# EAGLE design EddieBoardA_v2 (EAGLE 7.0.0)
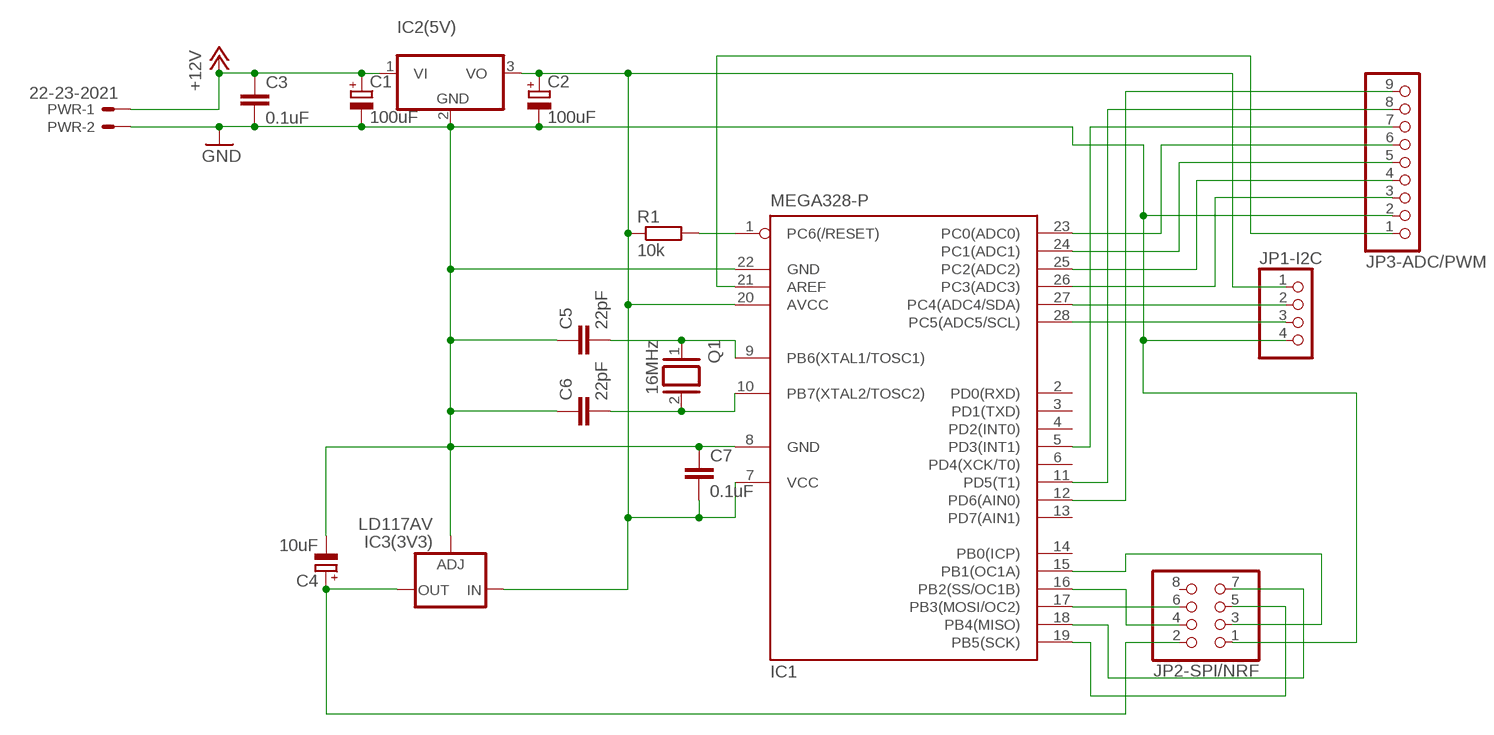
[diagram p0: schematic, sheet 1]

## Parts
C1  100uF  CPOL-EUE2.5-6  [E2,5-6]
C2  100uF  CPOL-EUE2.5-6  [E2,5-6]
C3  0.1uF  C-EU025-025X050  [C025-025X050]
C4  10uF  CPOL-EUE2.5-6  [E2,5-6]
C5  22pF  C-EU025-025X050  [C025-025X050]
C6  22pF  C-EU025-025X050  [C025-025X050]
C7  0.1uF  C-EU025-025X050  [C025-025X050]
IC1  MEGA328-P  MEGA8-P  [DIL28-3]
IC2(5V)  7805TV  [TO220V]
IC3(3V3)  LD117AV  [TO220L1]
JP1-I2C  PINHD-1X4  [1X04]
JP2-SPI/NRF  PINHD-2X4  [2X04]
JP3-ADC/PWM  PINHD-1X9  [1X09]
PWR  22-23-2021  [22-23-2021]
Q1  16MHz  XTAL/S  [QS]
R1  10k  R-EU_0207/12  [0207/12]

## Nets
3V3: C4.+ IC3(3V3).2(OUT) JP2-SPI/NRF.2
+12V: C1.+ C3.1 IC2(5V).1(VI) PWR.1
GND: C1.- C2.- C3.2 C4.- C5.1 C6.1 C7.1 IC1.8(GND) IC1.22(GND) IC2(5V).2(GND) IC3(3V3).1(ADJ) JP1-I2C.4 JP2-SPI/NRF.1 JP3-ADC/PWM.2 PWR.2
MISO: IC1.18(PB4(MISO)) JP2-SPI/NRF.7
MOSI: IC1.17(PB3(MOSI/OC2)) JP2-SPI/NRF.6
N$1: IC1.1(PC6(/RESET)) R1.2
N$4: C5.2 IC1.9(PB6(XTAL1/TOSC1)) Q1.1
N$5: C6.2 IC1.10(PB7(XTAL2/TOSC2)) Q1.2
N$8: IC1.15(PB1(OC1A)) JP2-SPI/NRF.3
N$12: IC1.21(AREF) JP3-ADC/PWM.1
N$13: IC1.26(PC3(ADC3)) JP3-ADC/PWM.3
N$14: IC1.25(PC2(ADC2)) JP3-ADC/PWM.4
N$15: IC1.24(PC1(ADC1)) JP3-ADC/PWM.5
N$16: IC1.23(PC0(ADC0)) JP3-ADC/PWM.6
N$19: IC1.5(PD3(INT1)) JP3-ADC/PWM.7
N$20: IC1.11(PD5(T1)) JP3-ADC/PWM.8
N$21: IC1.12(PD6(AIN0)) JP3-ADC/PWM.9
SCK: IC1.19(PB5(SCK)) JP2-SPI/NRF.5
SCL: IC1.28(PC5(ADC5/SCL)) JP1-I2C.3
SDA: IC1.27(PC4(ADC4/SDA)) JP1-I2C.2
SS: IC1.16(PB2(SS/OC1B)) JP2-SPI/NRF.4
VCC: C2.+ C7.2 IC1.7(VCC) IC1.20(AVCC) IC2(5V).3(VO) IC3(3V3).3(IN) JP1-I2C.1 R1.1
Unconnected: IC1.2(PD0(RXD)) IC1.3(PD1(TXD)) IC1.4(PD2(INT0)) IC1.6(PD4(XCK/T0)) IC1.13(PD7(AIN1)) IC1.14(PB0(ICP)) JP2-SPI/NRF.8

## Library data of the parts
C1 C2 C4 = rcl:CPOL-EU: POLARIZED CAPACITOR, European symbol
C3 C5-C7 = rcl:C-EU: CAPACITOR, European symbol
IC1 = atmel:MEGA8-P: MICROCONTROLLER 8 Kbytes FLASH, 1 kbytes SRAM, 512 bytes EEPROM, USART, 4-channel 10 bit ADC, 2-channel 8 bit ADC Pin compatible with Atmega48, ATMega88, ATMega168 Source: avr.lbr; OC_FARNELL: unknown; OC_NEWARK: unknown
IC2(5V) = linear:78*: Positive VOLTAGE REGULATOR Source: http://cache.national.com/ds/LM/LM78L05.pdf http://www.fairchildsemi.com/ds/LM/LM7805.pdf
IC3(3V3) = v-reg_2:LD117A?*: Low drop fixed and adjustable positive voltage regulators 1 A Source: http://www.st.com/stonline/products/literature/ds/7194/ld1117axx.pdf
JP1-I2C = pinhead:PINHD-1X4: PIN HEADER
JP2-SPI/NRF = pinhead:PINHD-2X4: PIN HEADER
JP3-ADC/PWM = pinhead:PINHD-1X9: PIN HEADER
PWR = con-molex:22-23-2021: .100" (2.54mm) Center Header - 2 Pin; MF: MOLEX; MPN: PWR; OC_FARNELL: 1462926; OC_NEWARK: 25C3832
Q1 = special:XTAL/S: CRYSTAL
R1 = resistor:R-EU_: RESISTOR, European symbol

## Board
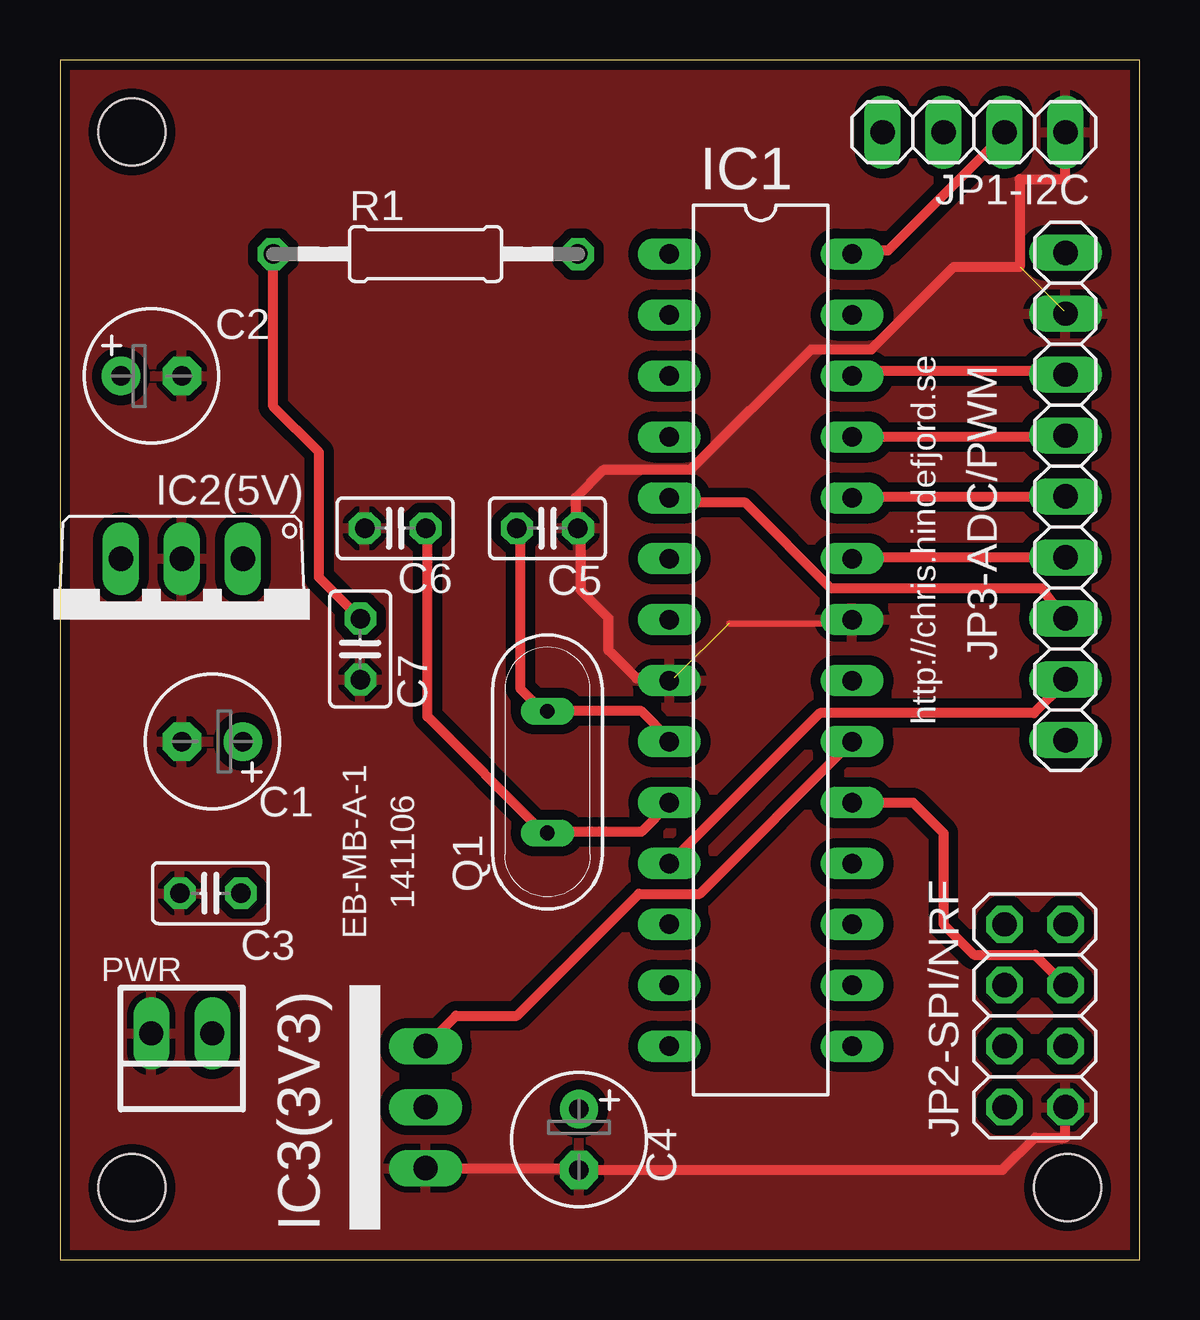
[diagram p1: board, top side]
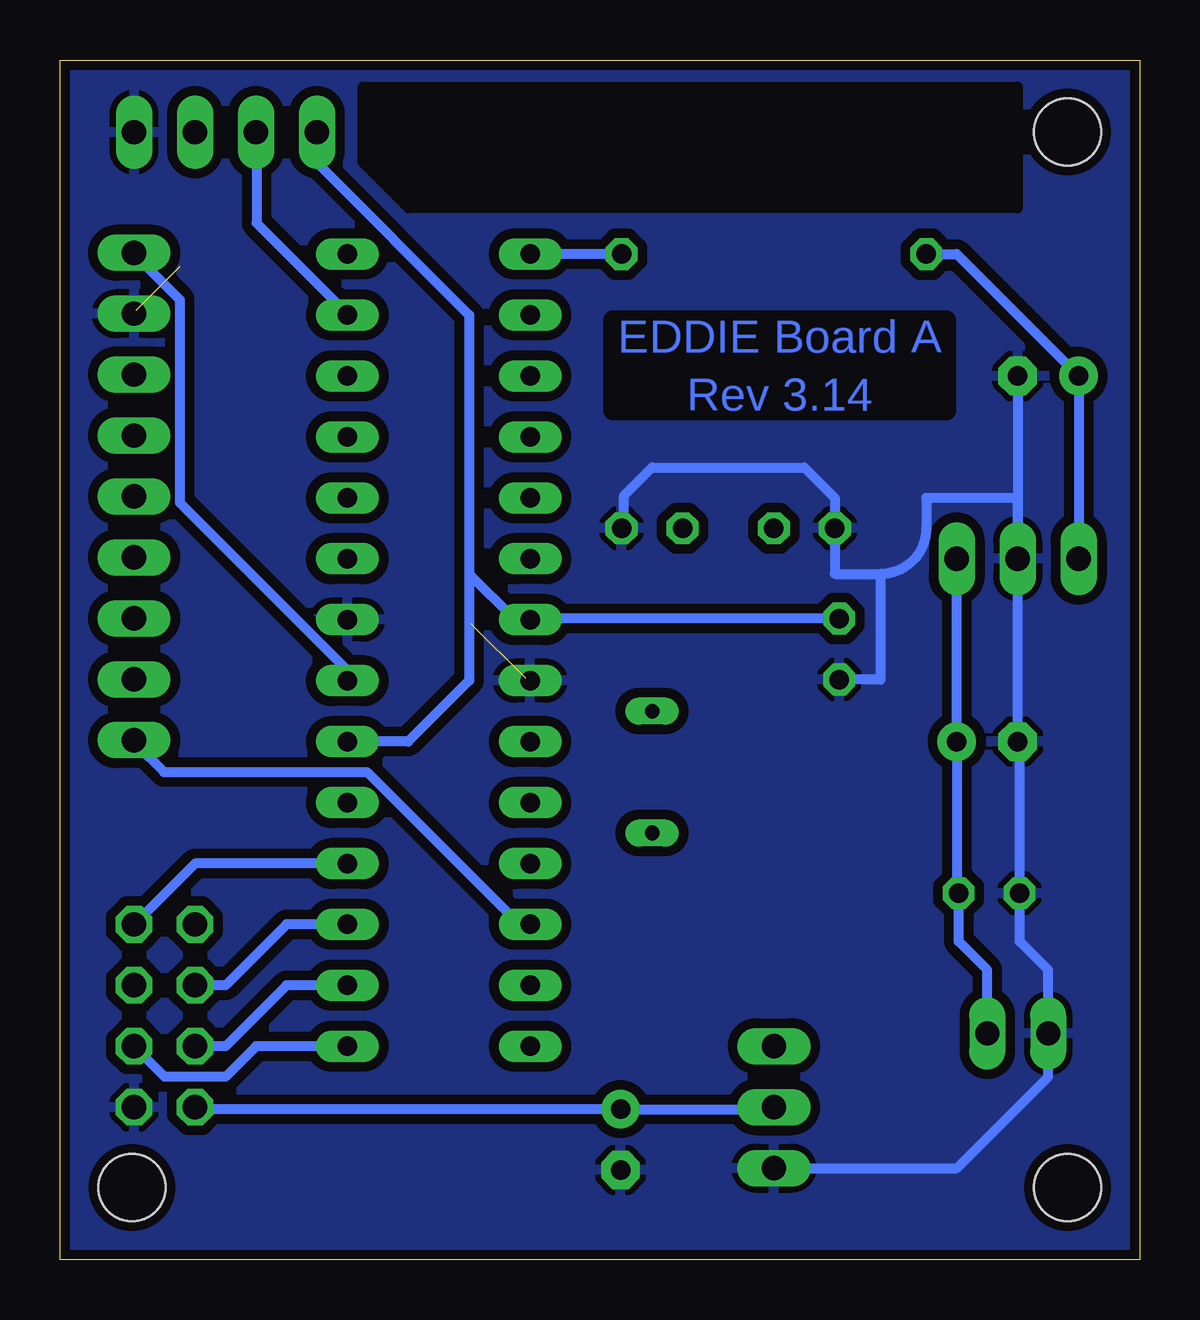
[diagram p2: board, bottom side, seen from below]

Size 45 x 50 mm. Coordinates in mm from the lower left corner, seen from the top.
Outline: 0,0 45,0 45,50 0,50 0,0
Copper layers (1*16): Top 0.035mm / dielectric 1.5mm / Bottom 0.035mm
Design rules "dirt_cheap_dirty_boards.v1": minimum track width 5mil, minimum drill 12mil, track to track 5mil, track to pad 5mil, pad to pad 5mil, via to via 5mil, smd to smd 0mil, copper to edge 10mil, drill to drill 10mil, minimum pad ring 10mil, minimum via ring 6mil, stop-mask expansion 2mil, vias tented up to drill 25mil, thermal gap 10mil
Holes 2.8 mm at 3,47 42,3 3,3

### Footprints (pad centres in the part's own frame; a part is rotated, then mirrored left to right if it is on the bottom)
E2,5-6 = drill 0.813 pad 1.6: + -1.27,0 | drill 0.813 pad 1.6 octagon: - 1.27,0
C025-025X050 = drill 0.813 octagon: 1 -1.27,0; 2 1.27,0
DIL28-3 = drill 0.813 long: 1 -16.51,-3.81; 2 -13.97,-3.81; 3 -11.43,-3.81; 4 -8.89,-3.81; 5 -6.35,-3.81; 6 -3.81,-3.81; 7 -1.27,-3.81; 8 1.27,-3.81; 9 3.81,-3.81; 10 6.35,-3.81; 11 8.89,-3.81; 12 11.43,-3.81; 13 13.97,-3.81; 14 16.51,-3.81; 15 16.51,3.81; 16 13.97,3.81; 17 11.43,3.81; 18 8.89,3.81; 19 6.35,3.81; 20 3.81,3.81; 21 1.27,3.81; 22 -1.27,3.81; 23 -3.81,3.81; 24 -6.35,3.81; 25 -8.89,3.81; 26 -11.43,3.81; 27 -13.97,3.81; 28 -16.51,3.81
TO220V = drill 1.016 long: 1 -2.54,-2.54; 2 0,-2.54; 3 2.54,-2.54
TO220L1 = drill 1.016 long: 1 -2.54,-3.81; 2 0,-3.81; 3 2.54,-3.81
1X04 = drill 1.016 long: 1 -3.81,0; 2 -1.27,0; 3 1.27,0; 4 3.81,0
2X04 = drill 1.016 octagon: 1 -3.81,-1.27; 2 -3.81,1.27; 3 -1.27,-1.27; 4 -1.27,1.27; 5 1.27,-1.27; 6 1.27,1.27; 7 3.81,-1.27; 8 3.81,1.27
1X09 = drill 1.016 long: 1 -10.16,0; 2 -7.62,0; 3 -5.08,0; 4 -2.54,0; 5 0,0; 6 2.54,0; 7 5.08,0; 8 7.62,0; 9 10.16,0
22-23-2021 = drill 1 long: 1 -1.27,0; 2 1.27,0
QS = drill 0.61 long: 1 -2.54,0; 2 2.54,0
0207/12 = drill 0.813 octagon: 1 -6.35,0; 2 6.35,0

### Placement (x,y rotation side)
C1  6.35,21.59 180 top
C2  3.81,36.83 0 top
C3  6.27,15.27 180 top
C4  21.64,5 270 top
C5  20.32,30.48 180 top
C6  13.97,30.48 0 top
C7  12.52,25.45 90 top
IC1  29.21,25.4 270 top
IC2(5V)  5.08,26.67 180 top
IC3(3V3)  11.43,6.35 90 top
JP1-I2C  38.1,46.99 0 top
JP2-SPI/NRF  40.64,10.16 90 top
JP3-ADC/PWM  41.91,31.81 270 top
PWR  5.08,9.43 180 top
Q1  20.32,20.32 270 top
R1  15.24,41.91 0 top

### Tracks (layer width: path | path; a pad name or v marks a point on that pad's centre or on a via)
3V3
  Bottom 0.406: IC3(3V3).2 15.32,6.27 C4.+ 39.29,6.27 JP2-SPI/NRF.2
+12V
  Bottom 0.406: IC2(5V).1 C1.+ 7.62,15.35 C3.1 7.54,13.26 6.35,12.06 PWR.1
GND  (2 unrouted)
  Top 0.254: 21.72,30.4 C5.1 21.72,30.63 | 25.38,24.23 IC1.8 25.6,24.23 | 27.89,26.52 32.92,26.52 IC1.22 | 41.83,46.86 JP1-I2C.4
  Top 0.406: 41.83,39.55 JP3-ADC/PWM.2 | 25.38,24.23 24.03,24.23 22.86,25.4 22.86,26.75 21.72,27.89 21.72,30.35 C5.1 21.49,30.58 21.49,31.75 22.66,32.92 26.29,32.92 31.32,37.95 33.83,37.95 37.26,41.38 40.01,41.38 40.01,45.03 41.91,45.03 JP1-I2C.4 | IC3(3V3).1 21.64,3.81 C4.- 39.29,3.73 40.64,5.08 41.91,5.08 JP2-SPI/NRF.1
  Bottom 0.254: 21.49,30.63 C5.1
  Bottom 0.406: 10.79,28.57 10.79,24.18 C7.1 12.52,24.32 | IC3(3V3).1 7.62,3.81 3.81,7.62 PWR.2 3.81,12.06 5,13.26 C3.2 5,21.51 C1.- IC2(5V).2 | C2.- IC2(5V).2 | 10.79,28.57 12.7,28.57 C6.1 12.7,31.75 13.97,33.02 20.32,33.02 21.49,31.85 21.49,30.63 | IC2(5V).2 5.08,31.75 8.89,31.75 8.89,30.48 arc90 10.79,28.57
  pour Bottom (isolate 0.406): 0,50.16 0,0 45.09,0 45.09,50.16
  pour Top (isolate 0.406): 0,50.16 0,0 45.09,0 45.09,50.16
MISO
  Bottom 0.406: IC1.18 39.37,16.51 JP2-SPI/NRF.7
MOSI
  Bottom 0.406: IC1.17 35.56,13.97 38.1,11.43 JP2-SPI/NRF.6
N$1
  Bottom 0.406: R1.2 IC1.1
N$3
  cutout Bottom: 5.08,48.9 5.08,43.81 30.48,43.81 32.38,45.72 32.38,48.9
N$4
  Top 0.254: 20.12,22.86 Q1.1
  Top 0.406: Q1.1 24.23,22.86 25.38,21.72 IC1.9 | 20.12,22.86 19.2,23.77 19.2,30.4 C5.2
N$5
  Top 0.254: 20.34,17.83 Q1.2 20.12,17.83 | 25.38,18.97 IC1.10 | 15.32,30.4 C6.2
  Top 0.406: 20.34,17.83 24.23,17.83 25.38,18.97 | 15.32,30.4 15.32,22.63 20.12,17.83
N$8
  Bottom 0.406: IC1.15 36.83,8.89 38.1,7.62 40.64,7.62 JP2-SPI/NRF.3
N$12
  Bottom 0.406: IC1.21 33.15,24.23 33.15,24.69 40.01,31.55 40.01,40.01 41.83,41.83 JP3-ADC/PWM.1
N$13
  Top 0.406: IC1.26 33.15,37.03 41.83,37.03 JP3-ADC/PWM.3
N$14
  Top 0.254: 41.83,34.29 JP3-ADC/PWM.4
  Top 0.406: 41.83,34.29 IC1.25
N$15
  Top 0.254: 33.15,31.77 IC1.24 | 41.83,31.77 JP3-ADC/PWM.5
  Top 0.406: 41.83,31.77 33.15,31.77
N$16
  Top 0.254: 33.15,29.26 IC1.23 | 41.83,29.26 JP3-ADC/PWM.6
  Top 0.406: 41.83,29.26 33.15,29.26
N$19
  Top 0.254: 41.83,26.75 JP3-ADC/PWM.7
  Top 0.406: 41.83,26.75 40.92,27.98 32.14,27.98 28.57,31.55 25.6,31.55 IC1.5
N$20
  Top 0.406: IC1.11 25.6,16.69 31.69,22.77 40.6,22.77 41.83,24 JP3-ADC/PWM.8
N$21
  Bottom 0.406: IC1.12 25.6,14.17 26.06,14.17 32.21,20.32 40.66,20.32 41.83,21.49 JP3-ADC/PWM.9
SCK
  Top 0.406: IC1.19 35.56,19.05 36.83,17.78 36.83,13.97 38.1,12.7 40.64,12.7 JP2-SPI/NRF.5
SCL
  Top 0.406: IC1.28 33.15,42.06 34.52,42.06 39.32,46.86 JP1-I2C.3
SDA
  Bottom 0.406: IC1.27 33.15,39.55 36.8,43.2 36.8,46.86 JP1-I2C.2
SS
  Bottom 0.406: IC1.16 35.56,11.43 38.1,8.89 JP2-SPI/NRF.4
VCC
  Top 0.406: C7.2 10.79,28.43 10.79,33.66 8.89,35.56 R1.1 | IC3(3V3).3 16.51,10.16 19.05,10.16 24.13,15.24 26.67,15.24 IC1.20
  Bottom 0.406: C7.2 25.4,26.71 IC1.7 26.04,26.67 27.94,28.57 | 27.94,28.57 27.94,24.13 30.48,21.59 IC1.20 | JP1-I2C.1 34.29,45.72 27.94,39.37 27.94,28.57 | R1.1 7.62,41.91 C2.+ IC2(5V).3

### Text on the board
Bottom: EDDIE Board A / Rev 3.14
tNames: http://chris.hindefjord.se | EB-MB-A-1 | 141106
Logo: EDDIE Board A / Rev 3.14